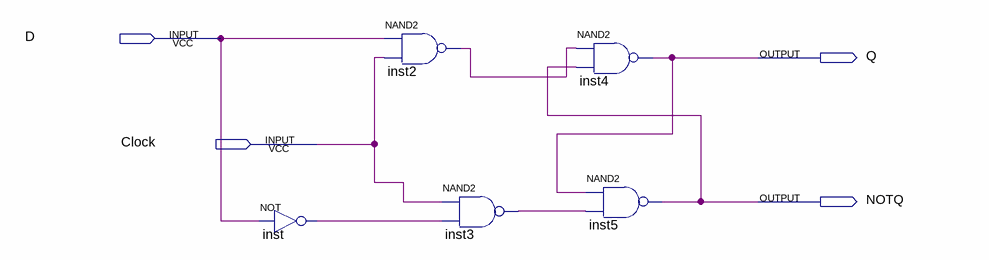
[diagram p0: schematic sheet]
// Quartus schematic Testar_na_placa.bdf as structural Verilog: 5 symbols, 4 pins
module Testar_na_placa (
  input  D,
  input  Clock,
  output Q,
  output NOTQ
);

  wire inst2_out, inst3_out, inst_out;

  not inst (inst_out, D);
  nand inst2 (inst2_out, D, Clock);
  nand inst3 (inst3_out, Clock, inst_out);
  nand inst4 (Q, inst2_out, NOTQ);
  nand inst5 (NOTQ, Q, inst3_out);
endmodule
